# EAGLE design IN-12-Arduino-Shield (EAGLE 7.7.0)
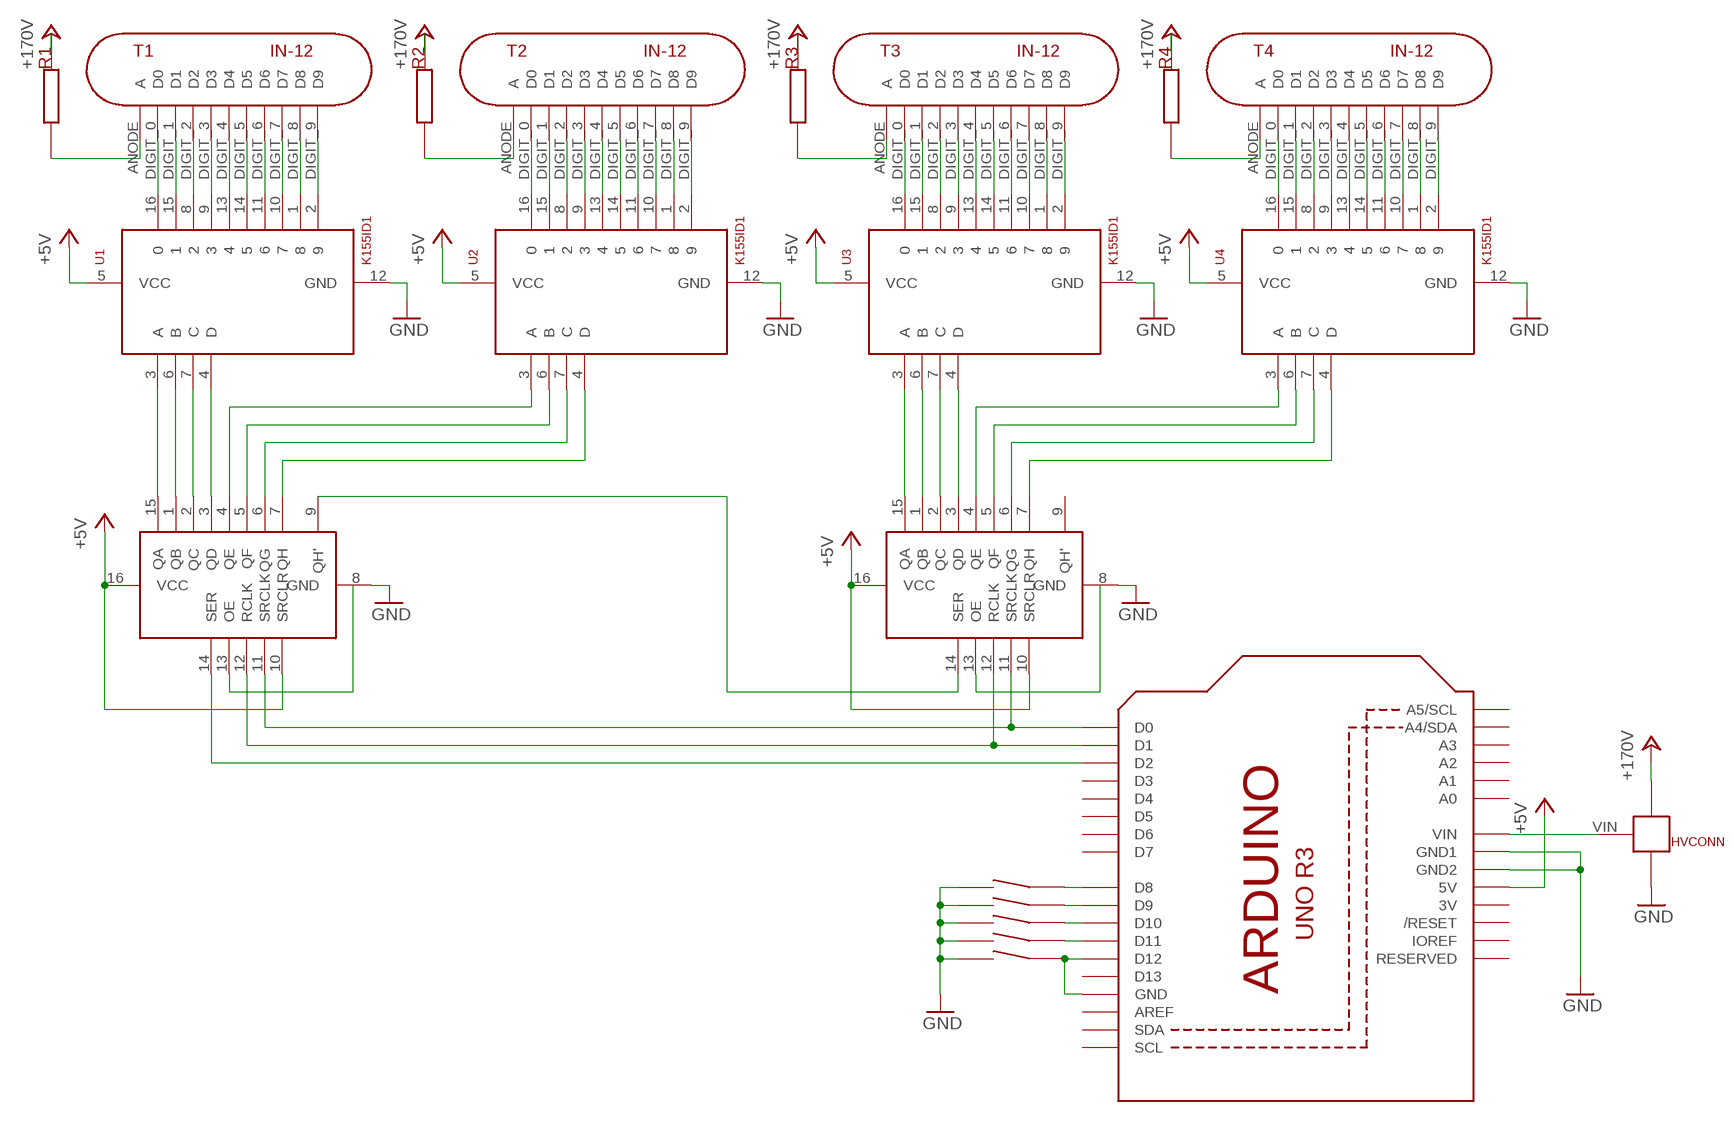
[diagram p0: schematic, sheet 1]

## Parts
HVCONN  HV_CONNECTOR  [HV_CONNECTOR]
R1  5,6K  ANODE_RESISTOR  [ANODE_RESISTOR]
R2  5,6K  ANODE_RESISTOR  [ANODE_RESISTOR]
R3  5,6K  ANODE_RESISTOR  [ANODE_RESISTOR]
R4  5,6K  ANODE_RESISTOR  [ANODE_RESISTOR]
T1  IN-12  [IN-12]
T2  IN-12  [IN-12]
T3  IN-12  [IN-12]
T4  IN-12  [IN-12]
U1  K155ID1  [DIP16-2.54-19.2X7.62MM]
U2  K155ID1  [DIP16-2.54-19.2X7.62MM]
U3  K155ID1  [DIP16-2.54-19.2X7.62MM]
U4  K155ID1  [DIP16-2.54-19.2X7.62MM]
U5  ARDUINOR3  [ARDUINOR3_NO_OUTLINE]
U6  74HC595  [DIL16]
U7  74HC595  [DIL16]
U$3  PUSHBUTTON  [PUSHBUTTON]
U$4  PUSHBUTTON  [PUSHBUTTON]
U$5  PUSHBUTTON  [PUSHBUTTON]
U$6  PUSHBUTTON  [PUSHBUTTON]
U$7  PUSHBUTTON  [PUSHBUTTON]

## Nets
+5V: U1.5(VCC) U2.5(VCC) U3.5(VCC) U4.5(VCC) U5.5V U6.10(SRCLR) U6.16(VCC) U7.10(SRCLR) U7.16(VCC)
+24V: HVCONN.+170V R1.P$2 R2.P$2 R3.P$2 R4.P$2 ; supply symbol labelled +170V
GND: HVCONN.GND U1.12(GND) U2.12(GND) U3.12(GND) U4.12(GND) U5.GND1 U5.GND2 U6.8(GND) U7.8(GND) U$3.P$1 U$4.P$1 U$5.P$1 U$6.P$1 U$7.P$1
N$1: T1.DIGIT_9(D9) U1.2
N$2: T1.DIGIT_8(D8) U1.1
N$3: T1.DIGIT_7(D7) U1.10
N$4: T1.DIGIT_6(D6) U1.11
N$5: T1.DIGIT_5(D5) U1.14
N$6: T1.DIGIT_4(D4) U1.13
N$7: T1.DIGIT_3(D3) U1.9
N$8: T1.DIGIT_2(D2) U1.8
N$9: T1.DIGIT_1(D1) U1.15
N$10: T1.DIGIT_0(D0) U1.16
N$11: R1.P$1 T1.ANODE(A)
N$12: T2.DIGIT_9(D9) U2.2
N$13: T2.DIGIT_8(D8) U2.1
N$14: T2.DIGIT_7(D7) U2.10
N$15: T2.DIGIT_6(D6) U2.11
N$16: T2.DIGIT_5(D5) U2.14
N$17: T2.DIGIT_4(D4) U2.13
N$18: T2.DIGIT_3(D3) U2.9
N$19: T2.DIGIT_2(D2) U2.8
N$20: T2.DIGIT_1(D1) U2.15
N$21: T2.DIGIT_0(D0) U2.16
N$22: R2.P$1 T2.ANODE(A)
N$23: T3.DIGIT_9(D9) U3.2
N$24: T3.DIGIT_8(D8) U3.1
N$25: T3.DIGIT_7(D7) U3.10
N$26: T3.DIGIT_6(D6) U3.11
N$27: T3.DIGIT_5(D5) U3.14
N$28: T3.DIGIT_4(D4) U3.13
N$29: T3.DIGIT_3(D3) U3.9
N$30: T3.DIGIT_2(D2) U3.8
N$31: T3.DIGIT_1(D1) U3.15
N$32: T3.DIGIT_0(D0) U3.16
N$33: R3.P$1 T3.ANODE(A)
N$34: T4.DIGIT_9(D9) U4.2
N$35: T4.DIGIT_8(D8) U4.1
N$36: T4.DIGIT_7(D7) U4.10
N$37: T4.DIGIT_6(D6) U4.11
N$38: T4.DIGIT_5(D5) U4.14
N$39: T4.DIGIT_4(D4) U4.13
N$40: T4.DIGIT_3(D3) U4.9
N$41: T4.DIGIT_2(D2) U4.8
N$42: T4.DIGIT_1(D1) U4.15
N$43: T4.DIGIT_0(D0) U4.16
N$44: R4.P$1 T4.ANODE(A)
N$45: U6.13(OE)
N$46: U7.13(OE)
N$47: U5.D11 U$7.P$2
N$48: U5.D10 U$6.P$2
N$49: U5.D0 U6.11(SRCLK) U7.11(SRCLK)
N$50: U5.D1 U6.12(RCLK) U7.12(RCLK)
N$51: U5.D2 U6.14(SER)
N$52: U5.D9 U$5.P$2
N$53: U5.D8 U$4.P$2
N$54: U5.D12 U5.GND U$3.P$2
N$55: HVCONN.VIN U5.VIN
N$67: U1.3(A) U6.15(QA)
N$68: U1.6(B) U6.1(QB)
N$69: U1.7(C) U6.2(QC)
N$70: U1.4(D) U6.3(QD)
N$71: U2.3(A) U6.4(QE)
N$72: U2.6(B) U6.5(QF)
N$73: U2.7(C) U6.6(QG)
N$74: U2.4(D) U6.7(QH)
N$75: U3.3(A) U7.15(QA)
N$76: U3.6(B) U7.1(QB)
N$77: U3.7(C) U7.2(QC)
N$78: U3.4(D) U7.3(QD)
N$79: U4.3(A) U7.4(QE)
N$80: U4.6(B) U7.5(QF)
N$81: U4.7(C) U7.6(QG)
N$82: U4.4(D) U7.7(QH)
N$91: U6.9(QH') U7.14(SER)
Unconnected: U5.A0 U5.A1 U5.A2 U5.A3 U5.A4(A4/SDA) U5.A5(A5/SCL) U5.AREF U5.D3 U5.D4 U5.D5 U5.D6 U5.D7 U5.D13 U5.IOREF U5.RESERVED U5.RESET(/RESET) U5.SCL U5.SDA U7.9(QH')

## Power pins joined to a net without a drawn wire
3V: U5.3V

## Library data of the parts
HVCONN = TimeExpander:HV_CONNECTOR
R1-R4 = TimeExpander:ANODE_RESISTOR: Anode resistor (Value is depending on drive voltage); VALUE: 22k
T1-T4 = TimeExpander:IN-12: Soviet IN-12 Nixie
U1-U4 = TimeExpander:K155ID1: Soviet version of SN74141 BCD to Decimal Decoder / Nixie Driver
U5 = TimeExpander:ARDUINOR3: This is a new object for the new Arduino R3 - with extra pins that you may want to use (such as IOref, and duplicated A4/A5
U6 U7 = TimeExpander:74HC595: 8-Bit Shift Register
U$3-U$7 = TimeExpander:PUSHBUTTON

## Board
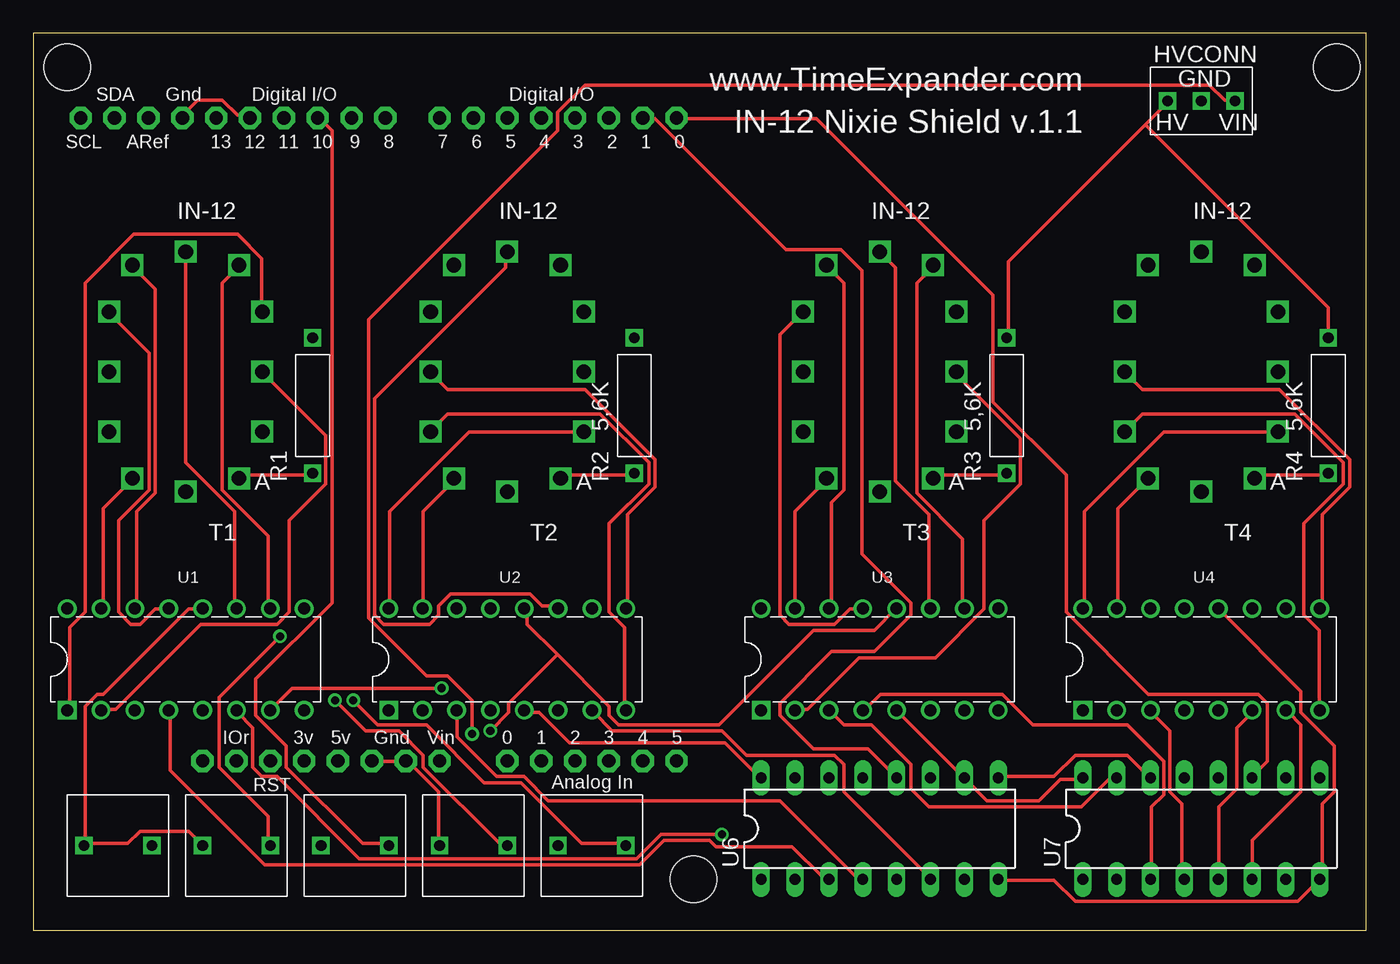
[diagram p1: board, top side]
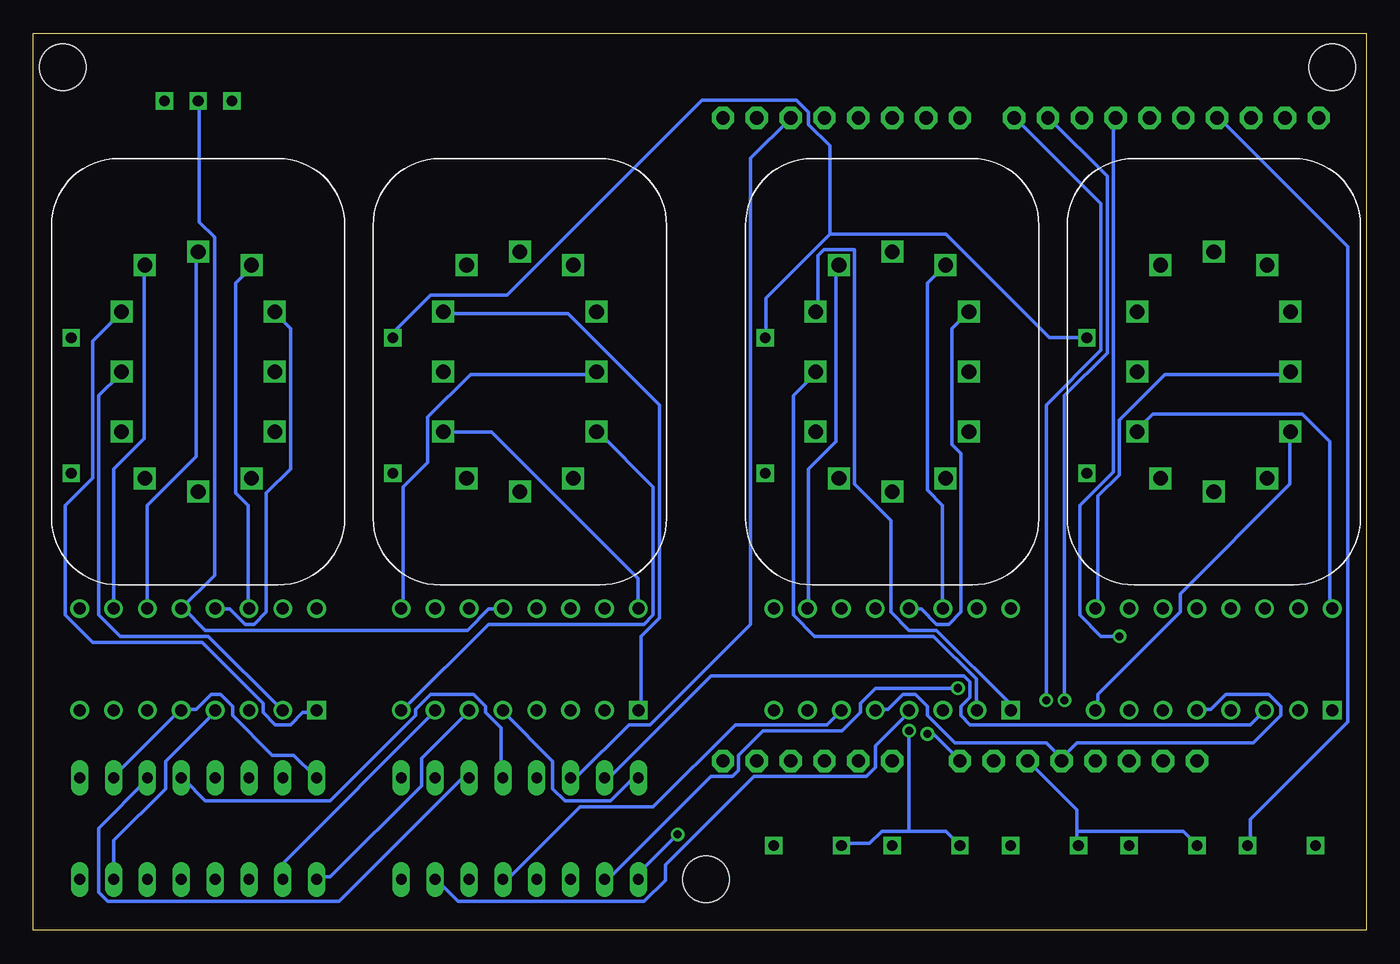
[diagram p2: board, bottom side, seen from below]

Size 100 x 67.3 mm. Coordinates in mm from the lower left corner, seen from the top.
Outline: 0,0 100,0 100,67.3 0,67.3 0,0
Copper layers (1*16): Top 0.035mm / dielectric 1.5mm / Bottom 0.035mm
Design rules "default": minimum track width 10mil, minimum drill 24mil, track to track 8mil, track to pad 8mil, pad to pad 8mil, via to via 8mil, smd to smd 8mil, copper to edge 40mil, drill to drill 8mil, minimum pad ring 10mil, minimum via ring 8mil, stop-mask expansion 4mil, vias tented up to drill 0mil, thermal gap 10mil
Holes 3.5 mm at 2.54,64.77 97.79,64.77 49.53,3.81

### Footprints (pad centres in the part's own frame; a part is rotated, then mirrored left to right if it is on the bottom)
HV_CONNECTOR = drill 0.8 square: +170V -5.08,2.54; GND -2.54,2.54; VIN 0,2.54
ANODE_RESISTOR = drill 0.8 square: P$1 0,0; P$2 10.16,0
IN-12 = drill 1.1 square: ANODE 4,-8; DIGIT_0 5.75,-4.5; DIGIT_1 -4,-8; DIGIT_2 -5.75,-4.5; DIGIT_3 -5.75,0; DIGIT_4 -5.75,4.5; DIGIT_5 -4,8; DIGIT_6 0,9; DIGIT_7 4,8; DIGIT_8 5.75,4.5; DIGIT_9 5.75,0; NC 0,-9
DIP16-2.54-19.2X7.62MM = drill 0.9 pad 1.4 square: 1 -8.89,-3.81 | drill 0.9 pad 1.4: 2 -6.35,-3.81; 3 -3.81,-3.81; 4 -1.27,-3.81; 5 1.27,-3.81; 6 3.81,-3.81; 7 6.35,-3.81; 8 8.89,-3.81; 9 8.89,3.81; 10 6.35,3.81; 11 3.81,3.81; 12 1.27,3.81; 13 -1.27,3.81; 14 -3.81,3.81; 15 -6.35,3.81; 16 -8.89,3.81
ARDUINOR3_NO_OUTLINE = drill 1 pad 1.676 octagon: 3V 35.56,2.54; 5V 38.1,2.54; A0 50.8,2.54; A1 53.34,2.54; A2 55.88,2.54; A3 58.42,2.54; A4 60.96,2.54; A5 63.5,2.54; AREF 23.876,50.8; D0 63.5,50.8; D1 60.96,50.8; D2 58.42,50.8; D3 55.88,50.8; D4 53.34,50.8; D5 50.8,50.8; D6 48.26,50.8; D7 45.72,50.8; D8 41.656,50.8; D9 39.116,50.8; D10 36.576,50.8; D11 34.036,50.8; D12 31.496,50.8; D13 28.956,50.8; GND 26.416,50.8; GND1 43.18,2.54; GND2 40.64,2.54; IOREF 30.48,2.54; RESERVED 27.94,2.54; RESET 33.02,2.54; SCL 18.796,50.8; SDA 21.336,50.8; VIN 45.72,2.54
DIL16 = drill 0.813 long: 1 -8.89,-3.81; 2 -6.35,-3.81; 3 -3.81,-3.81; 4 -1.27,-3.81; 5 1.27,-3.81; 6 3.81,-3.81; 7 6.35,-3.81; 8 8.89,-3.81; 9 8.89,3.81; 10 6.35,3.81; 11 3.81,3.81; 12 1.27,3.81; 13 -1.27,3.81; 14 -3.81,3.81; 15 -6.35,3.81; 16 -8.89,3.81
PUSHBUTTON = drill 0.8 square: P$1 -5.08,0; P$2 0,0

### Placement (x,y rotation side)
HVCONN  90.17,59.69 0 top
R1  20.95,34.29 90 top
R2  45.09,34.29 90 top
R3  73.03,34.29 90 top
R4  97.16,34.29 90 top
T1  11.43,41.91 0 top
T2  35.56,41.91 0 top
T3  63.5,41.91 0 top
T4  87.63,41.91 0 top
U1  11.43,20.32 0 top
U2  35.56,20.32 0 top
U3  63.5,20.32 0 top
U4  87.63,20.32 0 top
U5  -15.24,10.16 0 top
U6  63.5,7.62 0 top
U7  87.63,7.62 0 top
U$3  8.89,6.35 0 top
U$4  44.45,6.35 0 top
U$5  35.56,6.35 0 top
U$6  26.67,6.35 0 top
U$7  17.78,6.35 0 top

### Tracks (layer width: path | path; a pad name or v marks a point on that pad's centre or on a via)
+5V
  Top 0.254: U3.5 64.92,16.33 69.72,11.53 U6.10 69.95,11.3 71.55,9.7 75.44,9.7 77.04,11.3 78.64,11.3 U7.16 | U2.5 37.03,16.33 37.95,16.33 40.23,14.05 51.89,14.05 54.41,11.53 U6.16
  Bottom 0.254: 22.86,12.9 21.72,14.05 8.46,14.05 6.4,16.1 6.4,16.79 7.32,17.7 10.52,17.7 11.66,16.56 12.57,16.56 U1.5 | 22.86,12.9 24,14.05 30.86,14.05 32.92,16.1 32.92,16.79 33.83,17.7 34.75,17.7 35.89,16.56 36.8,16.56 U2.5 | 22.86,12.9 U5.5V | U7.10 93.95,11.53 88.92,16.56 U4.5 88.7,16.56 87.78,16.56 86.64,17.7 85.95,17.7 85.04,16.79 85.04,16.1 82.07,13.13 80.47,13.13 78.87,11.53 U7.16 | U6.16 54.63,11.3 55.09,11.3 56.69,9.7 60.12,9.7 61.04,10.62 61.04,12.68 64.69,16.33 U3.5
+24V
  Top 0.254: 83.44,60.45 85.04,62.05 HVCONN.+170V | 83.44,60.45 73.15,50.16 73.15,44.45 R3.P$2 | R4.P$2 97.16,46.74 83.44,60.45
  Bottom 0.254: R1.P$2 23.77,44.45 31.55,52.22 40.23,52.22 | 40.23,52.22 45.03,47.42 45.03,44.45 R2.P$2 | 40.23,52.22 40.23,58.85 41.83,60.45 41.83,61.37 42.75,62.28 49.84,62.28 64.47,47.65 70.18,47.65 72.92,44.91 72.92,44.45 R3.P$2
GND  (via drill 0.61)
  Top 0.254: U$5.P$1 30.4,6.5 30.4,10.39 28.12,12.68 U5.GND1 27.89,12.68 25.6,12.68 U5.GND2 | 3.89,6.5 7.09,6.5 8,7.42 11.66,7.42 12.57,6.5 U$7.P$1 | 3.89,6.5 3.89,16.79 4.8,17.7 5.26,17.7 11.66,24.11 12.57,24.11 U1.12 | 3.89,6.5 U$3.P$1 | 39.32,20.68 43.2,16.79 43.2,16.1 43.89,15.42 51.44,15.42 58.52,22.5 63.09,22.5 64.69,24.11 U3.12 | 39.32,20.68 37.03,22.96 37.03,24.11 U2.12 | U6.8 72.47,3.76 76.58,3.76 78.18,2.16 94.87,2.16 U7.8 96.7,3.99 96.7,9.47 97.61,10.39 97.61,13.82 95.1,16.33 95.1,17.93 U4.12 | v34.29,14.96 35.66,16.33 35.66,17.02 39.32,20.68
  Bottom 0.254: 21.72,7.42 21.72,9.02 U5.GND2 | 21.72,7.42 21.72,6.5 U$6.P$1 | 34.29,7.42 31.55,7.42 U$5.P$1 | 34.29,7.42 36.35,7.42 37.26,6.5 39.32,6.5 U$4.P$1 | 21.72,7.42 13.72,7.42 12.8,6.5 U$7.P$1 | HVCONN.GND 87.55,62.05 87.55,53.14 86.41,51.99 86.41,26.62 U4.12 88.7,24.11 87.1,22.5 67.44,22.5 65.84,24.11 64.92,24.11 U3.12 | v34.29,14.96 34.29,7.42
N$1
  Top 0.254: U1.2 5.26,16.56 6.17,16.56 12.57,22.96 18.29,22.96 19.2,23.88 19.2,30.73 21.95,33.48 21.95,37.13 17.37,41.71 T1.DIGIT_9
N$2
  Top 0.254: U1.1 2.74,16.56 2.74,22.73 3.89,23.88 3.89,48.56 7.54,52.22 15.32,52.22 17.14,50.39 17.14,46.51 T1.DIGIT_8
N$3
  Top 0.254: U1.10 17.6,24.33 17.6,29.59 14.17,33.02 14.17,48.56 15.32,49.71 T1.DIGIT_7
N$4
  Top 0.254: T1.DIGIT_6 11.43,35.08 15.09,31.42 15.09,24.33 U1.11
N$5
  Top 0.254: U1.14 7.77,24.33 7.77,31.42 9.14,32.79 9.14,48.11 7.54,49.71 T1.DIGIT_5
N$6
  Top 0.254: U1.13 10.06,24.11 9.14,24.11 8,22.96 7.32,22.96 6.4,23.88 6.4,30.73 8.69,33.02 8.69,43.31 5.71,46.28 T1.DIGIT_4
N$7
  Bottom 0.254: U1.9 20.12,24.33 20.12,32.56 18.52,34.16 18.52,38.28 15.09,41.71 5.71,41.71 T1.DIGIT_3
N$8
  Bottom 0.254: U1.8 20.12,16.56 20.12,17.7 13.95,23.88 13.95,25.25 5.71,33.48 5.71,37.36 T1.DIGIT_2
N$9
  Top 0.254: U1.15 5.26,24.33 5.26,31.65 7.32,33.71 T1.DIGIT_1
N$10
  Bottom 0.254: U1.16 2.74,24.33 2.74,36.68 4.8,38.73 16,38.73 17.14,37.59 T1.DIGIT_0
N$11
  Top 0.254: R1.P$1 20.8,34.16 15.77,34.16 15.54,33.93 T1.ANODE
N$12
  Bottom 0.254: U2.2 29.26,16.56 29.26,18.85 32.46,22.05 41.38,22.05 42.98,23.65 42.98,40.11 41.38,41.71 T2.DIGIT_9
N$13
  Bottom 0.254: U2.1 26.75,16.56 26.75,17.02 32.23,22.5 34.29,22.5 35.66,23.88 35.66,30.73 38.41,33.48 38.41,51.08 40.69,51.08 41.15,50.62 41.15,46.51 T2.DIGIT_8
N$14
  Bottom 0.254: U2.10 41.83,24.33 41.83,34.62 39.78,36.68 39.78,49.71 T2.DIGIT_7
N$15
  Top 0.254: U2.11 39.32,24.33 38.18,24.33 37.26,25.25 31.32,25.25 30.4,24.33 30.4,23.65 29.72,22.96 26.29,22.96 25.6,23.65 25.6,39.88 35.43,49.71 35.43,50.85 T2.DIGIT_6
N$16
  Bottom 0.254: U2.14 31.77,24.33 31.77,31.88 32.92,33.02 32.92,48.56 31.77,49.71 T2.DIGIT_5
N$17
  Bottom 0.254: U2.13 34.29,24.11 33.38,24.11 32.23,22.96 31.32,22.96 30.4,23.88 30.4,35.76 31.09,36.45 31.09,45.14 29.95,46.28 T2.DIGIT_4
N$18
  Top 0.254: U2.9 44.58,24.33 44.58,31.19 46.63,33.25 46.63,35.31 41.38,40.56 31.09,40.56 29.95,41.71 T2.DIGIT_3
N$19
  Top 0.254: U2.8 44.35,16.56 44.35,22.73 43.2,23.88 43.2,30.5 46.18,33.48 46.18,35.08 42.52,38.73 31.09,38.73 29.95,37.59 T2.DIGIT_2
N$20
  Top 0.254: U2.15 29.26,24.33 29.26,31.42 31.55,33.71 T2.DIGIT_1
N$21
  Top 0.254: U2.16 26.75,24.33 26.75,31.42 32.69,37.36 41.15,37.36 T2.DIGIT_0
N$22
  Top 0.254: R2.P$1 45.03,34.16 40.01,34.16 39.78,33.93 T2.ANODE
N$23
  Top 0.254: U3.2 57.15,16.56 58.06,16.56 61.95,20.45 67.67,20.45 71.32,24.11 71.32,30.73 74.07,33.48 74.07,36.91 69.27,41.71 T3.DIGIT_9
N$24
  Bottom 0.254: U3.1 54.41,16.56 54.41,22.05 53.03,23.42 53.03,39.42 59.89,46.28 69.04,46.28 T3.DIGIT_8
N$25
  Top 0.254: U3.10 69.72,24.33 69.72,29.36 66.29,32.79 66.29,48.56 67.44,49.71 T3.DIGIT_7
N$26
  Top 0.254: U3.11 67.21,24.33 67.21,31.19 64.69,33.71 64.69,49.71 63.55,50.85 T3.DIGIT_6
N$27
  Top 0.254: U3.14 59.89,24.33 59.89,32.11 60.81,33.02 60.81,48.56 59.66,49.71 T3.DIGIT_5
N$28
  Top 0.254: U3.13 62.18,24.11 61.27,24.11 60.12,22.96 56.69,22.96 56.01,23.65 56.01,44.68 57.61,46.28 T3.DIGIT_4
N$29
  Bottom 0.254: U3.9 72.24,24.33 72.24,33.25 70.41,35.08 70.41,38.51 67.21,41.71 57.84,41.71 T3.DIGIT_3
N$30
  Bottom 0.254: U3.8 72.24,16.56 65.84,22.96 54.18,22.96 53.49,23.65 53.49,33.25 57.61,37.36 T3.DIGIT_2
N$31
  Top 0.254: U3.15 57.15,31.42 59.44,33.71 T3.DIGIT_1
N$32
  Bottom 0.254: U3.16 54.63,24.33 54.63,26.39 65.61,37.36 69.04,37.36 T3.DIGIT_0
N$33
  Top 0.254: R3.P$1 72.92,34.16 67.89,34.16 67.67,33.93 T3.ANODE
N$34
  Bottom 0.254: U4.2 81.38,16.56 86.87,22.05 93.5,22.05 95.1,23.65 95.1,40.11 93.5,41.71 T4.DIGIT_9
N$35
  Bottom 0.254: U4.1 78.87,16.33 79.78,16.33 80.7,15.42 81.84,15.42 82.75,16.33 82.75,17.02 87.33,21.59 95.56,21.59 97.61,23.65 97.61,31.88 95.56,33.93 95.56,44.22 93.5,46.28 T4.DIGIT_8
N$36
  Bottom 0.254: U4.10 93.95,24.33 93.95,34.62 91.67,36.91 91.67,49.71 T4.DIGIT_7
N$37
  Bottom 0.254: U4.11 91.44,31.88 87.78,35.53 87.78,50.85 T4.DIGIT_6
N$38
  Bottom 0.254: U4.14 83.9,24.33 83.9,31.88 84.81,32.79 84.81,48.56 83.67,49.71 T4.DIGIT_5
N$39
  Bottom 0.254: U4.13 86.18,24.11 85.27,24.11 84.12,22.96 83.44,22.96 82.53,23.88 82.53,32.79 80.7,34.62 80.7,45.14 81.84,46.28 T4.DIGIT_4
N$40
  Top 0.254: U4.9 96.7,24.33 96.7,31.19 98.75,33.25 98.75,35.31 93.5,40.56 83.21,40.56 82.07,41.71 T4.DIGIT_3
N$41
  Top 0.254: U4.8 96.47,16.56 96.47,22.5 95.33,23.65 95.33,30.5 98.3,33.48 98.3,35.08 94.64,38.73 83.21,38.73 82.07,37.59 T4.DIGIT_2
N$42
  Top 0.254: U4.15 81.38,24.33 81.38,31.65 83.44,33.71 T4.DIGIT_1
N$43
  Top 0.254: U4.16 78.87,24.33 78.87,31.42 84.81,37.36 93.27,37.36 T4.DIGIT_0
N$44
  Top 0.254: R4.P$1 97.16,34.16 91.9,34.16 91.67,33.93 T4.ANODE
N$47  (via drill 0.61)
  Top 0.254: v18.52,22.05 13.95,17.48 13.95,12.22 17.6,8.56 17.6,6.5 U$7.P$2
  Bottom 0.254: v18.52,22.05 19.89,22.05 21.49,23.65 21.49,31.88 18.97,34.39 18.97,60.91 U5.D11
N$48
  Top 0.254: U$6.P$2 26.52,6.5 24.69,6.5 18.97,12.22 18.97,13.82 16.69,16.1 16.69,18.85 22.4,24.56 22.4,59.99 21.49,60.91 U5.D10
N$49
  Top 0.254: U5.D0 48.46,60.91 58.75,60.91 72.01,47.65 72.01,39.65 77.5,34.16 77.5,23.88 83.67,17.7 91.9,17.7 92.58,17.02 92.58,12.68 91.44,11.53 U7.11
  Bottom 0.254: U6.11 67.44,11.3 67.89,11.3 77.04,2.16 94.41,2.16 95.1,2.85 95.1,7.64 91.44,11.3 U7.11
N$50
  Top 0.254: U5.D1 45.72,60.91 46.63,60.91 56.46,51.08 60.58,51.08 62.18,49.48 62.18,28.22 65.84,24.56 65.84,23.65 63.09,20.9 59.89,20.9 56.01,17.02 56.01,16.1 58.52,13.59 62.64,13.59 64.69,11.53 U6.12
  Bottom 0.254: U6.12 64.92,11.53 64.92,15.19 66.06,16.33 66.06,16.79 66.98,17.7 70.18,17.7 71.32,16.56 71.32,16.1 77.72,9.7 87.1,9.7 88.7,11.3 U7.12
N$51
  Bottom 0.254: U6.14 59.66,11.53 59.21,11.53 55.32,15.42 53.72,15.42 46.18,22.96 46.18,57.94 43.2,60.91 U5.D2
N$52  (via drill 0.61)
  Top 0.254: v22.63,17.25 24.92,14.96 27.43,14.96 29.26,13.13 29.26,12.22 34.98,6.5 35.43,6.5 U$5.P$2
  Bottom 0.254: v22.63,17.25 22.63,40.11 19.43,43.31 19.43,56.57 23.77,60.91 U5.D9
N$53  (via drill 0.61)
  Top 0.254: v24,17.25 25.83,15.42 29.49,15.42 33.83,11.07 36.58,11.07 41.15,6.5 44.35,6.5 U$4.P$2
  Bottom 0.254: v24,17.25 24,39.42 19.89,43.54 19.89,54.51 26.29,60.91 U5.D8
N$54
  Top 0.254: U5.D12 16.23,61.14 15.32,61.14 14.17,62.28 12.34,62.28 11.2,61.14 U5.GND
  Bottom 0.254: U$3.P$2 8.69,6.5 8.69,8.33 1.37,15.65 1.37,51.31 10.97,60.91 U5.GND
N$55  (via drill 0.61)
  Top 0.254: v32.92,14.73 32.92,17.25 31.09,19.07 29.49,19.07 25.15,23.42 25.15,45.82 39.32,59.99 39.32,61.37 41.38,63.42 88.24,63.42 89.38,62.28 90.07,62.28 HVCONN.VIN
  Bottom 0.254: v32.92,14.73 32.46,14.73 30.63,12.9 U5.VIN
N$67
  Bottom 0.254: U6.15 57.15,11.53 56.69,11.53 49.15,19.07 30.18,19.07 29.72,18.62 29.72,17.48 30.4,16.79 30.4,16.1 29.72,15.42 8.69,15.42 7.77,16.33 U1.3
N$68  (via drill 0.61)
  Top 0.254: v51.66,7.19 47.09,7.19 45.26,5.36 24.46,5.36 18.29,11.53 17.14,11.53 16.46,12.22 16.46,15.19 15.32,16.33 U1.6
  Bottom 0.254: v51.66,7.19 54.41,4.45 54.41,3.99 U6.1
N$69  (via drill 0.61)
  Top 0.254: v30.63,18.16 19.43,18.16 U1.7
  Bottom 0.254: v30.63,18.16 36.8,18.16 37.95,17.02 37.95,16.33 39.32,14.96 45.26,14.96 47.09,13.13 47.09,11.99 47.55,11.53 49.15,11.53 56.69,3.99 57.15,3.99 U6.2
N$70
  Top 0.254: U6.3 59.66,3.99 59.21,3.99 56.92,6.27 51.21,6.27 50.75,6.73 47.32,6.73 45.49,4.9 17.37,4.9 10.29,11.99 10.29,16.33 U1.4
N$71
  Top 0.254: U6.4 62.18,3.99 61.72,3.99 56.01,9.7 38.63,9.7 36.8,11.53 34.75,11.53 31.77,14.5 31.77,16.33 U2.3
N$72
  Bottom 0.254: U2.6 40.46,15.42 47.32,15.42 53.49,9.25 58.98,9.25 64.24,3.99 64.69,3.99 U6.5
N$73
  Top 0.254: U6.6 67.21,3.99 60.81,10.39 60.81,12.45 60.12,13.13 53.49,13.13 51.66,14.96 43.43,14.96 42.06,16.33 U2.7
N$74
  Bottom 0.254: U6.7 69.72,3.76 68.12,2.16 54.18,2.16 52.58,3.76 52.58,4.9 45.95,11.53 37.49,11.53 36.8,12.22 36.8,13.82 34.29,16.33 U2.4
N$75
  Top 0.254: U7.15 81.15,11.3 80.7,11.3 78.64,9.25 67.21,9.25 65.84,10.62 65.84,12.45 62.87,15.42 60.81,15.42 59.89,16.33 U3.3
N$76
  Bottom 0.254: U7.1 78.64,3.99 77.72,3.99 70.87,10.85 70.87,12.9 67.44,16.33 U3.6
N$77
  Bottom 0.254: U7.2 81.15,3.99 81.15,5.13 69.95,16.33 U3.7
N$78
  Top 0.254: U7.3 83.9,3.99 83.9,9.25 84.81,10.16 84.81,12.68 82.07,15.42 74.98,15.42 72.69,17.7 63.55,17.7 62.41,16.56 U3.4
N$79
  Top 0.254: U7.4 86.18,3.99 86.18,9.47 85.27,10.39 85.27,14.96 83.9,16.33 U4.3
N$80
  Top 0.254: U7.5 88.92,3.99 88.92,9.25 90.3,10.62 90.3,15.19 91.44,16.33 U4.6
N$81
  Top 0.254: U7.6 91.44,6.73 95.1,10.39 95.1,15.42 94.18,16.33 U4.7
N$82
  Bottom 0.254: U7.7 93.95,3.99 93.95,6.73 90.07,10.62 90.07,12.68 86.41,16.33 U4.4
N$91
  Top 0.254: U6.9 72.47,11.53 76.58,11.53 78.18,13.13 82.07,13.13 83.67,11.53 U7.14

### Text on the board
tPlace: www.TimeExpander.com | IN-12 Nixie Shield v.1.1